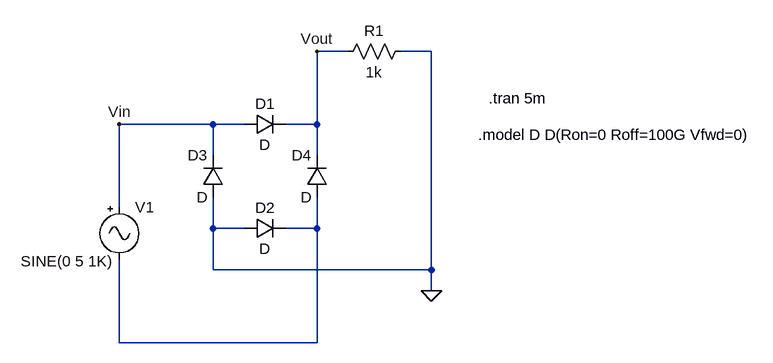
[diagram p0: schematic BridgeRectifier.asc]
BridgeRectifier.asc, the LTspice schematic file:
Version 4
SHEET 1 1176 680
WIRE 512 -128 464 -128
WIRE 640 -128 592 -128
WIRE 304 -16 160 -16
WIRE 352 -16 304 -16
WIRE 464 -16 464 -128
WIRE 464 -16 416 -16
WIRE 304 32 304 -16
WIRE 464 32 464 -16
WIRE 160 112 160 -16
WIRE 304 144 304 96
WIRE 352 144 304 144
WIRE 464 144 464 96
WIRE 464 144 416 144
WIRE 304 208 304 144
WIRE 640 208 640 -128
WIRE 640 208 304 208
WIRE 640 240 640 208
WIRE 160 320 160 192
WIRE 464 320 464 144
WIRE 464 320 160 320
FLAG 464 -128 Vout
FLAG 160 -16 Vin
FLAG 640 240 0
SYMBOL diode 352 0 R270
WINDOW 0 32 32 VTop 2
WINDOW 3 0 32 VBottom 2
SYMATTR InstName D1
SYMBOL diode 352 160 R270
WINDOW 0 32 32 VTop 2
WINDOW 3 0 32 VBottom 2
SYMATTR InstName D2
SYMBOL diode 320 96 R180
WINDOW 0 24 64 Left 2
WINDOW 3 24 0 Left 2
SYMATTR InstName D3
SYMBOL diode 480 96 R180
WINDOW 0 24 64 Left 2
WINDOW 3 24 0 Left 2
SYMATTR InstName D4
SYMBOL res 608 -144 R90
WINDOW 0 0 56 VBottom 2
WINDOW 3 32 56 VTop 2
SYMATTR InstName R1
SYMATTR Value 1k
SYMBOL Misc\\signal 160 96 R0
WINDOW 123 0 0 Left 0
WINDOW 39 0 0 Left 0
WINDOW 3 -10 99 Right 2
SYMATTR Value SINE(0 5 1K)
SYMATTR InstName V1
TEXT 728 -56 Left 2 !.tran 5m
TEXT 712 0 Left 2 !.model D D(Ron=0 Roff=100G Vfwd=0)

The netlist it stands for:
* BridgeRectifier.asc
D1 Vin Vout D
D2 0 N001 D
D3 0 Vin D
D4 N001 Vout D
R1 0 Vout 1k
V1 Vin N001 SINE(0 5 1K)
.model D D
.lib standard.dio
.tran 5m
.model D D(Ron=0 Roff=100G Vfwd=0)
.backanno
.end